# Altium schematic sheet Communications.SchDoc
size A4; SheetNumber: 6; SheetTotal: 16
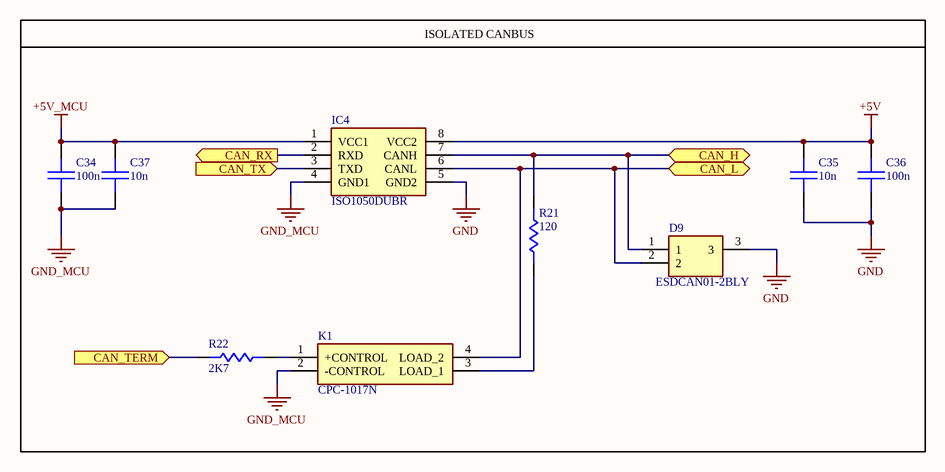
[diagram p0: Communications.SchDoc]

## Parts
C34  100n  [C_0603]
C35  10n  [C_0603]
C36  100n  [C_0603]
C37  10n  [C_0603]
D9  ESDCAN01-2BLY  [SOT95P255X125-3N]
IC4  ISO1050DUBR  [SOP254P1040X485-8N]
K1  CPC-1017N  [SOP254P610X206-4N]
R21  120  [R_0603]
R22  2K7  [R_0603]

## Blocks framed on the sheet
ISOLATED CANBUS: C34-C37 D9 IC4 K1 R21 R22

## Ports
CAN_H (bidir, see Interconnections[2B], Main_Connector[1B]), CAN_L (bidir, see Interconnections[2B], Main_Connector[1B]), CAN_RX (out, see Interconnections[3B], Microcontroller[4A]), CAN_TERM (in, see Interconnections[3B], Microcontroller[4A]), CAN_TX (in, see Interconnections[3B], Microcontroller[4A])

## Nets
+5V: C35.1 C36.1 IC4.8(VCC2)
+5V_MCU: C34.2 C37.1 IC4.1(VCC1)
GND: C35.2 C36.2 D9.3 IC4.5(GND2)
GND_MCU: C34.1 C37.2 IC4.4(GND1) K1.2(-CONTROL)
CAN_H: D9.1 IC4.7(CANH) R21.2 ; port CAN_H
CAN_L: D9.2 IC4.6(CANL) K1.4(LOAD_2) ; port CAN_L
CAN_RX: IC4.2(RXD) ; port CAN_RX
CAN_TERM: R22.2 ; port CAN_TERM
CAN_TX: IC4.3(TXD) ; port CAN_TX
NetK1_1: K1.1(+CONTROL) R22.1
NetK1_3: K1.3(LOAD_1) R21.1

## Library data of the parts
C34-C37 = CAP: SMD Chip Capacitor
D9 = ESDCAN01-2BLY: TVS Diode (Bi-directional); Manufacturer_Name: STMicroelectronics; Datasheet Link: https://componentsearchengine.com/Datasheets/2/ESDCAN01-2BLY.pdf; Height: 1.25mm; Manufacturer_Part_Number: ESDCAN01-2BLY; Mouser Part Number: 511-ESDCAN01-2BLY; Mouser Price/Stock: https://www.mouser.co.uk/ProductDetail/STMicroelectronics/ESDCAN01-2BLY?qs=Ok1pvOkw6%2FpNzC2RQnWwPA%3D%3D; Arrow Part Number: ESDCAN01-2BLY; Arrow Price/Stock: https://www.arrow.com/en/products/esdcan01-2bly/stmicroelectronics?region=nac
IC4 = ISO1050DUBR: Integrated Circuit; Manufacturer_Name: Texas Instruments; Datasheet Link: http://www.ti.com/lit/ds/symlink/iso1050.pdf; Height: 4.85mm; Manufacturer_Part_Number: ISO1050DUBR; Mouser Part Number: 595-ISO1050DUBR; Mouser Price/Stock: https://www.mouser.co.uk/ProductDetail/Texas-Instruments/ISO1050DUBR?qs=IK5e5L0zOXhhp9hdAolE%252BA%3D%3D; Arrow Part Number: ISO1050DUBR; Arrow Price/Stock: https://www.arrow.com/en/products/iso1050dubr/texas-instruments?region=europe
K1 = CPC-1017N: Relay or Contactor; Manufacturer_Name: LITTELFUSE; Datasheet Link: http://www.ixysic.com/home/pdfs.nsf/www/CPC1017N.pdf/$file/CPC1017N.pdf; Height: 2.055mm; Manufacturer_Part_Number: CPC-1017N
R21 R22 = RES: SMD Chip Resistor